# Altium schematic sheet TELM0005_TempSenseHIGH.SchDoc: Temperature Sensor Circuit
size A3; Engineer: A. SHAW; Organization: BLUEsat Project; Address1: Room 419; Address2: School of EE&T; Address3: UNSW, NSW 2052; Address4: Australia; DocumentNumber: TELM0003; SheetNumber: 1; SheetTotal: 1; Version: 1.0
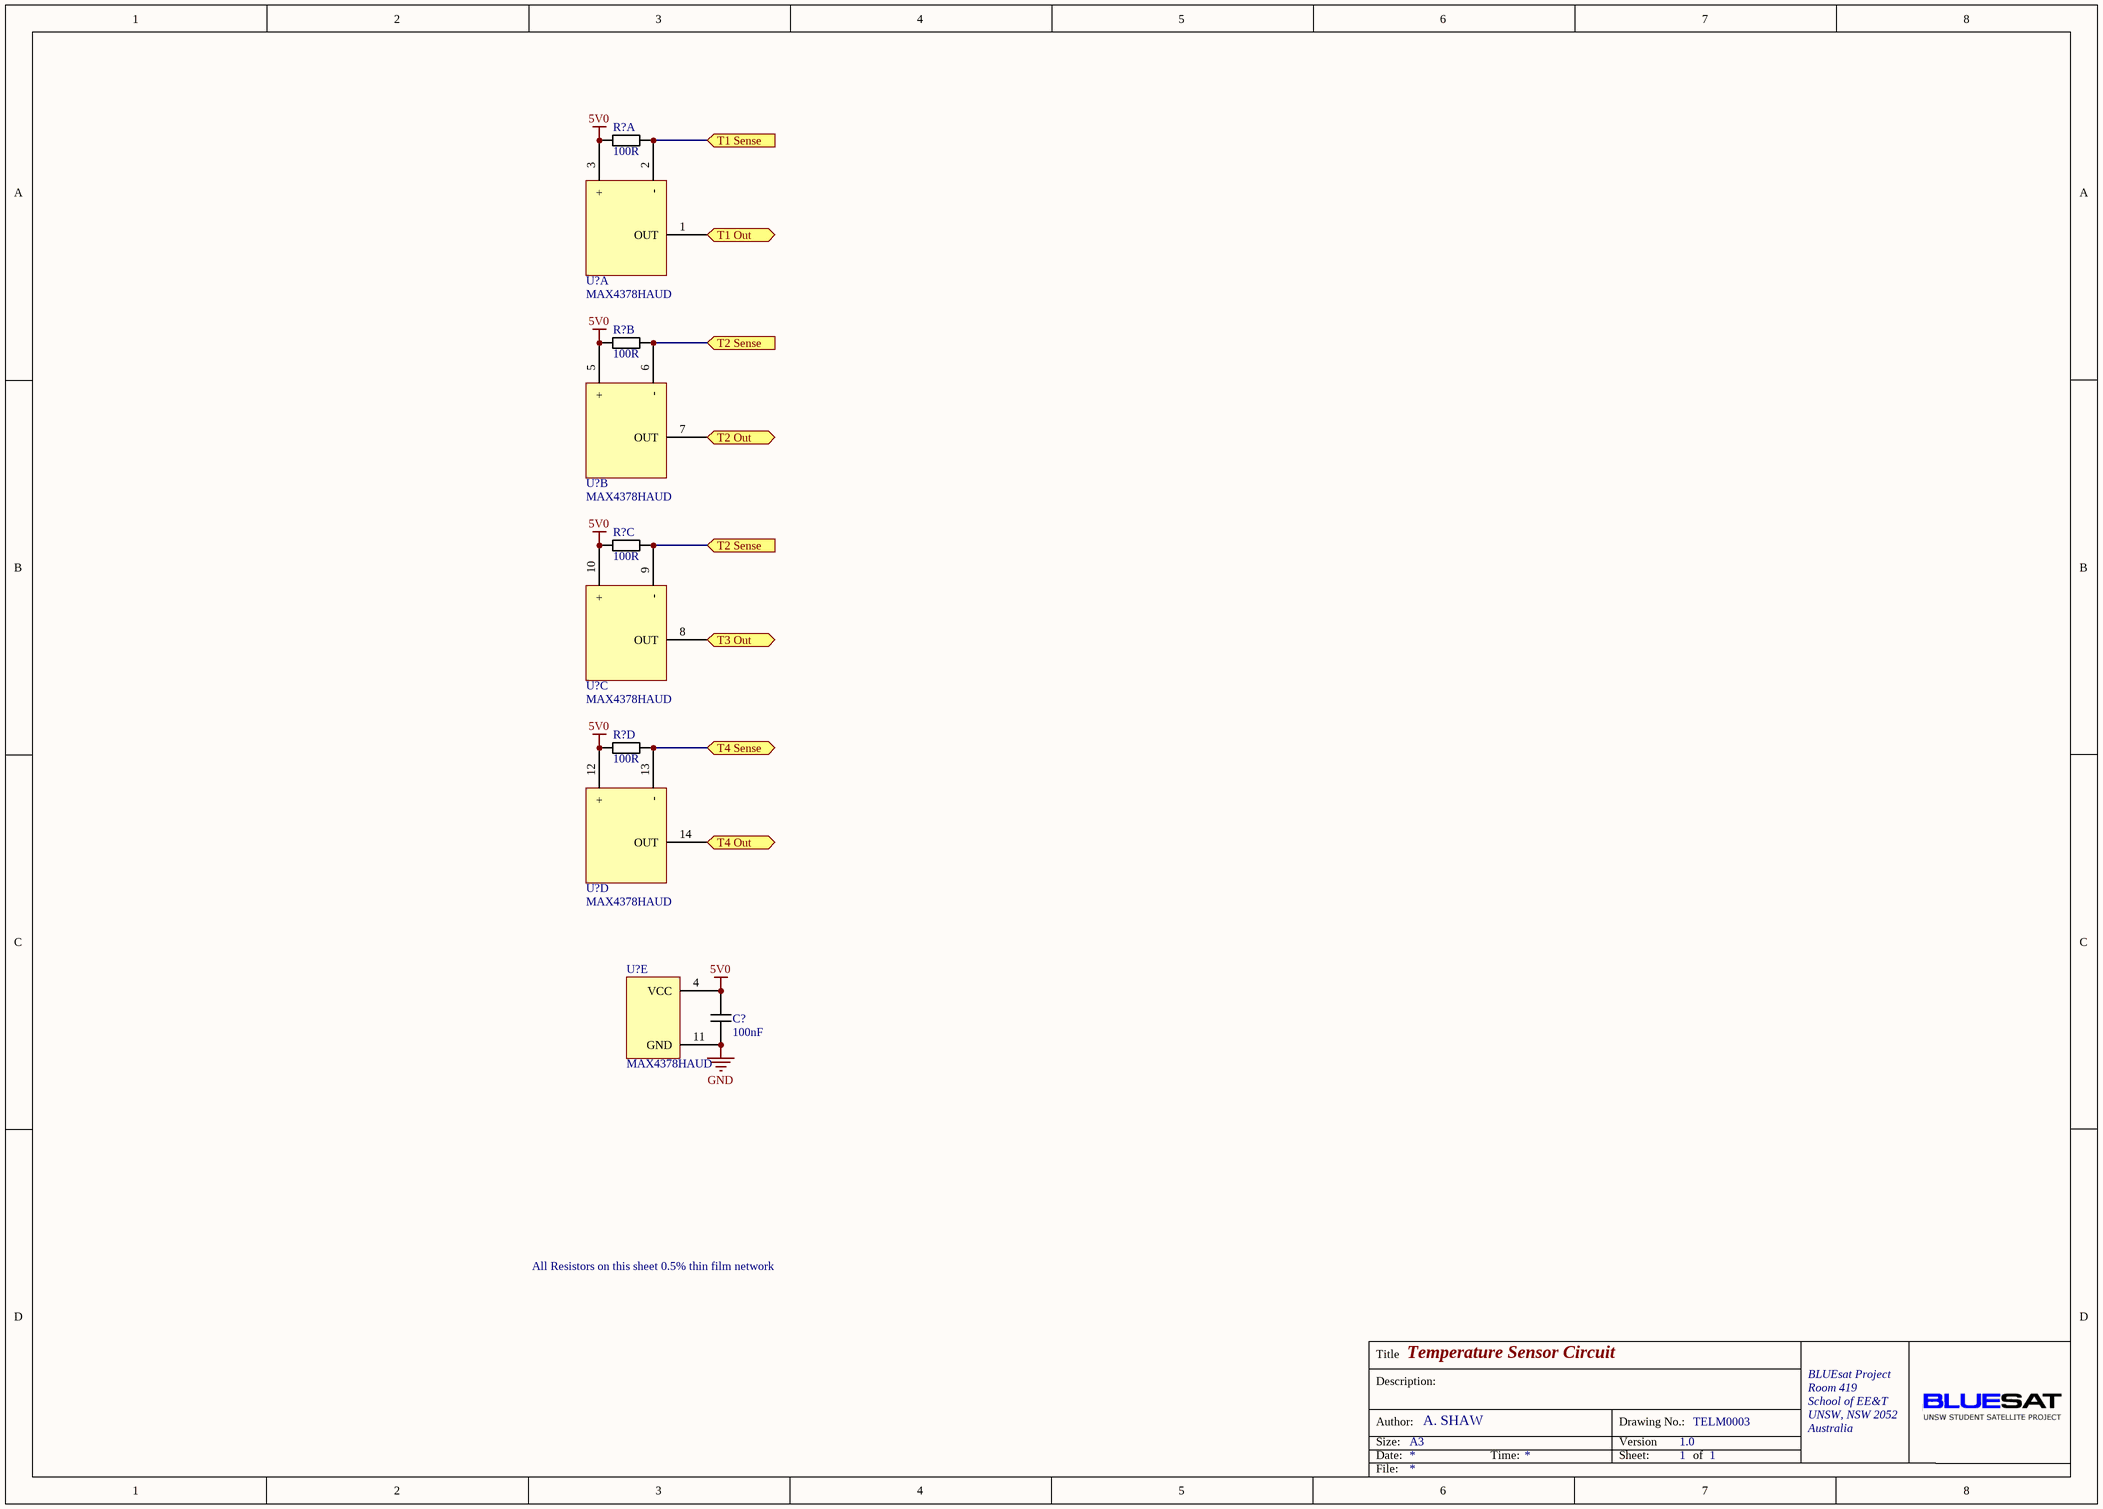
[diagram p0: TELM0005_TempSenseHIGH.SchDoc]

## Parts
(Parts that share a designator on the sheet are numbered #1, #2 ... from top to bottom, then left to right.)
C?  value 100nF  [0805 Cap]  (hidden comment: 0805 Cap)
R?#1  value 100R  [ACAS_0612_AC]  (hidden comment: Resistor Network)  (part A of 4)
R?#2  value 100R  [ACAS_0612_AC]  (hidden comment: Resistor Network)  (part B of 4)
R?#3  value 100R  [ACAS_0612_AC]  (hidden comment: Resistor Network)  (part C of 4)
R?#4  value 100R  [ACAS_0612_AC]  (hidden comment: Resistor Network)  (part D of 4)
U?#1  MAX4378HAUD  [TSOP14]  (part A of 5)
U?#2  MAX4378HAUD  [TSOP14]  (part B of 5)
U?#3  MAX4378HAUD  [TSOP14]  (part C of 5)
U?#4  MAX4378HAUD  [TSOP14]  (part D of 5)
U?#5  MAX4378HAUD  [TSOP14]  (part E of 5)

## Ports
T1 Out (out), T1 Sense (in), T2 Out (out), T2 Sense (in), T3 Out (out), T4 Out (out), T4 Sense

## Nets
5V0: C?.2 R?#1.1 R?#2.2 R?#3.3 R?#4.4 U?#1.3(+) U?#2.5(+) U?#3.10(+) U?#4.12(+) U?#5.4(VCC)
GND: C?.1 U?#5.11(GND)
T1 Out: U?#1.1(OUT) ; port T1 Out
T1 Sense: R?#1.8 U?#1.2(-) ; port T1 Sense
T2 Out: U?#2.7(OUT) ; port T2 Out
T2 Sense: R?#2.7 R?#3.6 U?#2.6(-) U?#3.9(-) ; port T2 Sense
T3 Out: U?#3.8(OUT) ; port T3 Out
T4 Out: U?#4.14(OUT) ; port T4 Out
T4 Sense: R?#4.5 U?#4.13(-) ; port T4 Sense

## Notes on the sheet
- All Resistors on this sheet 0.5% thin film network
- Title
- Description:
- Size:
- Author:
- Date:
- A3
- Time:
- Version
- Sheet:
- Drawing No.:
- of
- File:

## Library data of the parts
C? = 0805 MLCC - X7R, 10%
R?#1-R?#4 = RN4_1